# Altium schematic sheet AnalogIn.SchDoc
size A4; Organization: Altium Limited; Address1: L3, 12a Rodborough Rd; Address2: Frenchs Forest; Address3: NSW; Address4: Australia 2086
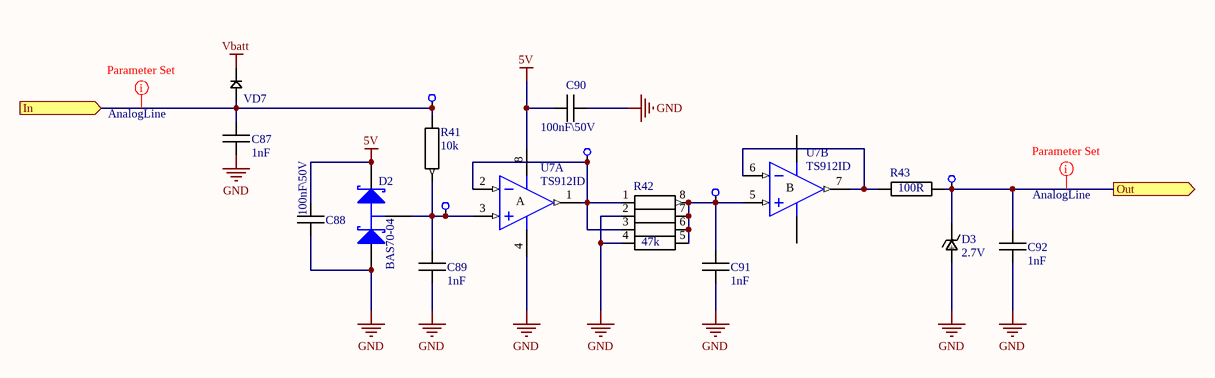
[diagram p0: AnalogIn.SchDoc]

## Parts
C87  1nF  [SMD 0603]
C88  100nF\50V  [SMD 0603]
C89  1nF  [SMD 0603]
C90  100nF\50V  [SMD 0603]
C91  1nF  [SMD 0603]
C92  1nF  [SMD 0603]
D2  BAS70-04  [SOT23_N]
D3  2.7V  [SOD123]
R41  10k  [SMD 0603]
R42  47k  [YC164]
R43  100R  [SMD 0603]
TP59  TestPoint  [TESTPOINT]  (value not drawn)
TP60  TestPoint  [TESTPOINT]  (value not drawn)
TP61  TestPoint  [TESTPOINT]  (value not drawn)
TP62  TestPoint  [TESTPOINT]  (value not drawn)
TP63  TestPoint  [TESTPOINT]  (value not drawn)
U7  TS912ID  [SO8_N]  (parts A,B of 2)
VD7  Diode  [SOD323]  (value not drawn)

## Ports
In (in), Out (out)

## Nets
5V: C88.1 C90.2 D2.2(K) U7.8(V+)
GND: C87.1 C88.2 C89.1 C90.1 C91.1 C92.1 D2.1(A) D3.- R42.2 R42.4 U7.4(V-)
Vbatt: VD7.1
In: C87.2 R41.1 TP59.0 VD7.0 ; port In
Out: C92.2 D3.+ R43.2 TP63.0 ; port Out
NetC89_2: C89.2 D2.3(C) R41.2 TP60.0 U7.3(IN+)
NetC91_2: C91.2 R42.5 R42.6 R42.7 R42.8 TP62.0 U7.5(IN+)
NetR42_1: R42.1 R42.3 TP61.0 U7.1(OUT) U7.2(IN-)
NetR43_1: R43.1 U7.6(IN-) U7.7(OUT)

Not connected (* = marked no-connect by the designer): U7 14(V-) 18(V+)

## Layout directives
net class AnalogLine: In, Out

## Notes on the sheet
- Title
- Size:
- Date:
- A4
- Number:
- Time:
- Revision:
- Sheet
- of
- File:
- (in symbol TS912ID, part A) A
- (in symbol TS912ID, part B) B

## Library data of the parts
C87 C89 C91 C92 = Capasitor: CC0603KRX7R9BB102; Value: 1nF
C88 C90 = Capasitor: CC0603KRX7R9BB104; Value: 100nF\50V
D2 = BAS70-04: Schottky Barrier Double Diode; Published: 17-Sep-2003; LatestRevisionDate: 12-Dec-2006; LatestRevisionNote: IPC-7351 Footprint Added.; DatasheetVersion: 11-Oct-2001; PackageVersion: May-1999; PackageReference: SOT23; Publisher: Altium Limited; PackageDescription: 3-Pin SOT-23 Package 0.95 mm Pitch, 2.3 mm Lead Span; ComponentLink1Description: Manufacturer Link; ComponentLink1URL: http://www.semiconductors.philips.com/; ComponentLink2Description: Datasheet; ComponentLink2URL: http://www.semiconductors.philips.com/acrobat/datasheets/BAS70_SERIES_6.pdf
D3 = Zener: MMSZ2V7T1G; pin to pad: +>1 ->0; value: 2.7V
R41 = Resistor: RC0603FR-0710KL; Value: 10k
R42 = YC164: YC164-JR-0747KL; value: 47k
R43 = Resistor: RC0603FR-07100RL; Value: 100R
U7 = TS912ID: Rail-to-Rail CMOS Dual Operational Amplifier; Published: 24-Aug-2001; LatestRevisionDate: 13-Apr-2006; LatestRevisionNote: IPC-7351 Footprint Added.; DatasheetVersion: Apr-1999; PackageVersion: Dec-2002; PackageReference: SO8; Publisher: Altium Limited; PackageDescription: 8-Pin Small Outline Integrated Circuit 1.27 mm Pitch; Code_JEDEC: MS-012-AA; Code_IPC: SOIC127P600-8; ComponentLink1Description: Manufacturer Link; ComponentLink1URL: http://www.st.com/; ComponentLink2Description: Datasheet; ComponentLink2URL: http://www.st.com/stonline/products/literature/ds/2325/ts912.pdf
VD7 = Diode: PMEG2020EJ.115; pin to pad: 0>2